# Altium project LCD_VGA.PrjPCB
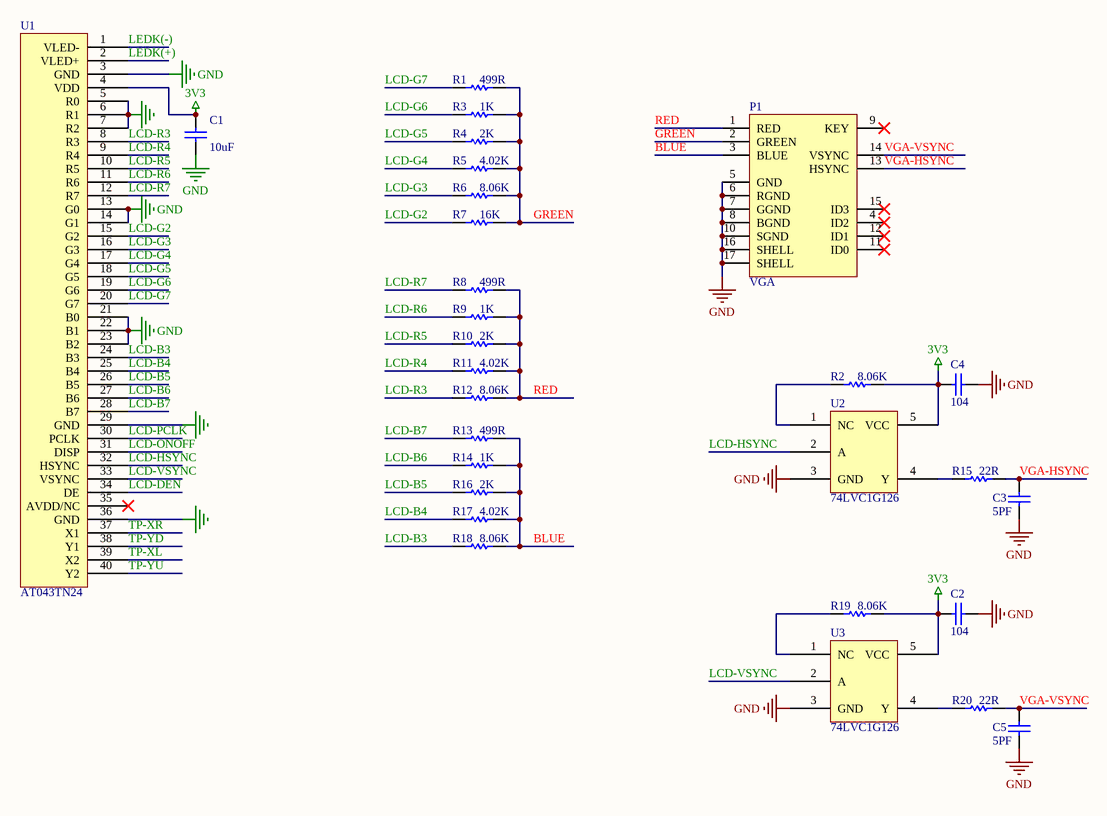
[diagram p0: LCD_VGA.SchDoc]
1 sheet, 29 parts. Net scope: global (net labels, ports and power ports of the same name join across sheets).
Board file: LCD_VGA.PcbDoc

## Sheet LCD_VGA.SchDoc
size A4

### Parts
C1  C10uF  [0603C]  (value not drawn)
C2  104  [0603C]
C3  5PF  [0603C]
C4  104  [0603C]
C5  5PF  [0603C]
P1  VGA  [VGA-DB15]
R1  499R  [0603R]
R2  8.06K  [0603R]
R3  1K  [0603R]
R4  2K  [0603R]
R5  4.02K  [0603R]
R6  8.06K  [0603R]
R7  16K  [0603R]
R8  499R  [0603R]
R9  1K  [0603R]
R10  2K  [0603R]
R11  4.02K  [0603R]
R12  8.06K  [0603R]
R13  499R  [0603R]
R14  1K  [0603R]
R15  22R  [0603R]
R16  2K  [0603R]
R17  4.02K  [0603R]
R18  8.06K  [0603R]
R19  8.06K  [0603R]
R20  22R  [0603R]
U1  AT043TN24  [FPC40-N]
U2  74LVC1G126  [SOT23-5]
U3  74LVC1G126  [SOT23-5]

### Nets
3V3: C1.1 C2.2 C4.2 R2.1 R19.1 U1.4(VDD) U2.5(VCC) U3.5(VCC)
GND: C1.2 C2.1 C3.2 C4.1 C5.2 P1.5(GND) P1.6(RGND) P1.7(GGND) P1.8(BGND) P1.10(SGND) P1.16(SHELL) P1.17(SHELL) U1.3(GND) U1.5(R0) U1.6(R1) U1.7(R2) U1.13(G0) U1.14(G1) U1.21(B0) U1.22(B1) U1.23(B2) U1.29(GND) U1.36(GND) U2.3(GND) U3.3(GND)
BLUE: P1.3(BLUE) R13.1 R14.1 R16.1 R17.1 R18.1
GREEN: P1.2(GREEN) R1.1 R3.1 R4.1 R5.1 R6.1 R7.1
LCD-B3: R18.2 U1.24(B3)
LCD-B4: R17.2 U1.25(B4)
LCD-B5: R16.2 U1.26(B5)
LCD-B6: R14.2 U1.27(B6)
LCD-B7: R13.2 U1.28(B7)
LCD-DEN: U1.34(DE)
LCD-G2: R7.2 U1.15(G2)
LCD-G3: R6.2 U1.16(G3)
LCD-G4: R5.2 U1.17(G4)
LCD-G5: R4.2 U1.18(G5)
LCD-G6: R3.2 U1.19(G6)
LCD-G7: R1.2 U1.20(G7)
LCD-HSYNC: U1.32(HSYNC) U2.2(A)
LCD-ONOFF: U1.31(DISP)
LCD-PCLK: U1.30(PCLK)
LCD-R3: R12.2 U1.8(R3)
LCD-R4: R11.2 U1.9(R4)
LCD-R5: R10.2 U1.10(R5)
LCD-R6: R9.2 U1.11(R6)
LCD-R7: R8.2 U1.12(R7)
LCD-VSYNC: U1.33(VSYNC) U3.2(A)
LEDK(+): U1.2(VLED+)
LEDK(-): U1.1(VLED-)
RED: P1.1(RED) R8.1 R9.1 R10.1 R11.1 R12.1
TP-XL: U1.39(X2)
TP-XR: U1.37(X1)
TP-YD: U1.38(Y1)
TP-YU: U1.40(Y2)
VGA-HSYNC: C3.1 P1.13(HSYNC) R15.1
VGA-VSYNC: C5.1 P1.14(VSYNC) R20.1
NetR2_2: R2.2 U2.1(NC)
NetR15_2: R15.2 U2.4(Y)
NetR19_2: R19.2 U3.1(NC)
NetR20_2: R20.2 U3.4(Y)

Not connected (* = marked no-connect by the designer): P1 4(ID2)* 9(KEY)* 11(ID0)* 12(ID1)* 15(ID3)*; U1 35(AVDD/NC)*

### Notes on the sheet
- (in symbol C10uF-B) 10uF

### Library data of the parts
C1-C5 = C10uF-B
R1-R20 = R1M
U2 U3 = 74LVC1G17